# Altium schematic sheet Sheet1.SchDoc
size A4; SheetNumber: 1; SheetTotal: 1
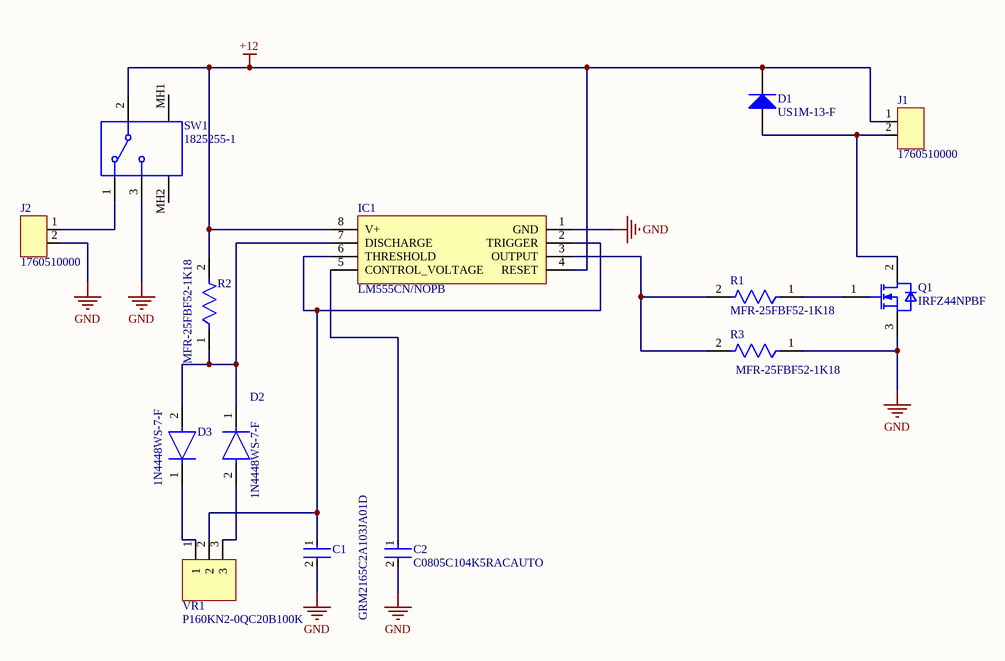
[diagram p0: Sheet1.SchDoc]

## Parts
C1  GRM2165C2A103JA01D  [FP-GRM216-0_1-0_05-IPC_C]
C2  C0805C104K5RACAUTO  [FP-C0805C-DN-MFG]
D1  US1M-13-F  [DIOD-SMA-2_A_V]
D2  1N4448WS-7-F  [FP-SOD323-MFG]
D3  1N4448WS-7-F  [FP-SOD323-MFG]
IC1  LM555CN/NOPB  [DIP794W45P254L959H508Q8]
J1  1760510000  [1760490000]
J2  1760510000  [1760490000]
Q1  IRFZ44NPBF  [IFX-PG-TO220-3-904-1]
R1  MFR-25FBF52-1K18  [FP-MFR-25-MFG]
R2  MFR-25FBF52-1K18  [FP-MFR-25-MFG]
R3  MFR-25FBF52-1K18  [FP-MFR-25-MFG]
SW1  1825255-1  [TECO-1825255-1_V]
VR1  P160KN2-0QC20B100K  [IC3_P160KN2-0QC20B100K_BIT]

## Nets
+12: D1.2(K) IC1.4(RESET) IC1.8(V+) J1.1 R2.2 SW1.2
GND: C1.2 C2.2 IC1.1(GND) J2.2 Q1.3(SOURCE) R3.1 SW1.3
NetC1_1: C1.1 IC1.2(TRIGGER) IC1.6(THRESHOLD) VR1.2
NetC2_1: C2.1 IC1.5(CONTROL_VOLTAGE)
NetD1_1: D1.1(A) J1.2 Q1.2(DRAIN)
NetD2_1: D2.1(C) D3.2(A) IC1.7(DISCHARGE) R2.1
NetD2_2: D2.2(A) VR1.3
NetD3_1: D3.1(C) VR1.1
NetIC1_3: IC1.3(OUTPUT) R1.2 R3.2
NetJ2_1: J2.1 SW1.1
NetQ1_1: Q1.1(GATE) R1.1

Not connected (* = marked no-connect by the designer): SW1 MH1 MH2

## Library data of the parts
C1 = CMP-06035-017805-1: Chip Multilayer Ceramic Capacitors for General Purpose, 0805, 10000pF, C0G, 30ppm/°C, 5%, 100V
C2 = CMP-2007-00278-2: CAP CER 0.1UF 50V X7R 0805; Manufacturer: KEMET; Material: Ceramic; Tolerance: 0.1; Capacitance: 0.10 μF; Value: 0.10 μF; Description: C0805 0.10 μF X7R 30ppm/°C 10.00% 50 V; Temperature Coefficient: 30ppm/°C; Voltage Rating: 50 V; Device Class L1: Passive Components; Device Class L3: Ceramic Capacitors; Temperature Characteristic: X7R; Manufacturer Part Number: C0805C104K5RACAUTO; Mouser Description: Multilayer Ceramic Capacitors MLCC - SMD/SMT 0.1uF 50volts 10% AUTO; Package: C0805C-DN; Digikey Description: CAP CER 0.1UF 50V X7R 0805; Height: 0.88mm; Automotive: No; Device Class L2: Capacitors; Category: Cap; Temperature: -55°C to +125°C; ComponentLink2URL: https://content.kemet.com/datasheets/KEM_C1003_C0G_SMD.pdf; Lead Free: Yes; Temperature Range Low: -55°C; Temperature Range High: +125°C; RoHS: TRUE; Ipc Land Pattern Name: CAPC200125X78; ComponentLink2Description: Datasheet; Octopart: https://octopart.com/c0805c104k5racauto-kemet-12625097
D1 = CMP-2000-07364-1: Ultra-Fast Rectifier, 1 A, 1.7 V, -65 to 150 degC, 2-Pin SMA, RoHS, Tape and Reel; Manufacturer: Diodes Inc; Forward Voltage: 1.7V; Reverse Recovery Time-Max: 75ns; Average Rectified Current-Max: 1A; Reverse Current-Max: 5µA; Reverse Voltage-Max [Vrrm]: 1000V; Package Description: 2-Pin Surface Mount Device, Body 4.3 x 2.605 mm; Datasheet URL: http://www.diodes.com/_files/datasheets/ds16008.pdf; Datasheet Version: Rev. 11-2, 12/2014; Package Reference: SMA-2; Mounting Technology: SurfaceMount; Manufacturer URL: http://www.diodes.com/
D2 D3 = CMP-12791-000011-1: DIODE GEN PURP 75V 250MA SOD323; Manufacturer: Diodes Incorporated; Forward Current: 500mA; Max Junction Temp: +150°C; Max Surge Forward Current: 0.5A; Value: 4pF; Peak Reverse Current: 2.5uA; Standoff Height: 0.05mm; ComponentLink2URL: https://www.diodes.com/assets/Datasheets/ds30096.pdf; ComponentLink2Description: Datasheet; Automotive: No; Temperature Range Low: -65°C; Package: SOD323; Temperature Range High: +150°C; Device Class L3: Rectifier Diodes; Reverse Voltage: 75V; Device Class L2: Diodes; Max Repetitive Reverse Voltage: 75V; Manufacturer Part Number: 1N4448WS-7-F; RoHS: TRUE; Lead Free: Yes; Temperature: -65°C to +150°C; Mouser Description: 1N4448WS Series 4 A 75 V 200 mW Surface Mount Fast Switching Diode - SOD-323; Capacitance: 4pF; Height: 1.2mm; Digikey Description: DIODE GEN PURP 75V 250MA SOD323; Octopart: https://octopart.com/1n4448ws-7-f-diodes+inc.-55389585; Footprint Url: https://www.diodes.com/assets/Package-Files/SOD323.pdf; Device Class L1: Discrete Semiconductors; Category: Diode
IC1 = LM555CN/NOPB: IC OSC SINGLE TIMER 100KHZ 8-DIP "555 Type, Timer/Oscillator (Single) IC 100kHz 8-PDIP"; Manufacturer: Texas Instruments; Manufacturer Lifecycle Status: ACTIVE; Manufacturer Package Identifier: P(R-PDIP--T8); Current Rating: 200A; High Level Output Current: -200mA; Low Level Output Current: 200mA; Max Junction Temperature (Tj): 70°C; Max Power Dissipation: 1.18W; Max Supply Voltage: 16V; Min Supply Voltage: 4.5V; Nominal Supply Current: 3mA; Number of Channels: 1; Operating Supply Current: 10mA; Supplier: DigiKey; Supplier Part Number: LM555CNNS/NOPB-ND; Manufacturer Part Number: LM555CN/NOPB; RoHS: Compliant; Category: Timers and Oscillators; Stock: 14598; Pricing: 1=1.44, 10=1.045, 40=0.90625, 120=0.82858, 280=0.78304, 520=0.75596, 1000=0.73206, 2520=0.70495, 5000=0.68894 (USD); Ambient Temperature Range High: 70°C; Case/Package: PDIP; Contact Plating: Tin; Frequency: 100kHz; Height: 5.08mm; Lead Free: Lead Free; Length: 9.81mm; Lifecycle Status: Production; Max Operating Temperature: 70°C; Min Operating Temperature: 0°C; Mount: Through Hole; Number of Pins: 8; Number of Timers/Counters: 1; Output Current: 200mA; Power Dissipation: 1.18W; Quiescent Current: 3mA; Radiation Hardening: No; REACH SVHC: Unaffected; Schedule B: 8542390000, 8542390000|8542390000|8542390000|8542390000|8542390000|8542390000|8542390000|8542390000|8542390000|8542390000|8542390000|8542390000|8542390000|8542390000|8542390000|8542390000|8542390000|8542390000|8542390000|8542390000|8542390000|8542390000|8542390000|85; Thickness: 3.9mm; Weight: 4.535924g; Width: 6.35mm; ComponentLink1URL: https://datasheet.octopart.com:443/LM555CN-NOPB-Texas-Instruments-datasheet-39144970.pdf?src-supplier=Texas+Instruments; ComponentLink1Description: https://datasheet.octopart.com:443/LM555CN-NOPB-Texas-Instruments-datasheet-39144970.pdf?src-supplier=Texas+Instruments; ComponentLink2URL: https://octopart.com:443/opatz8j6/c1?t=P9WJEuKpBNBQUNyDZTk4jrYEfZFxStfoFvCVy4zyfSvKfndzEk-HPsDKw6nWdCdN9BYUaBjSdlQxEtgzEOfQqYUxHZYj0MFD8BtoaQrN98rnk2ABdG3YuZhLly47aMb-yaBTjmH8iFOuBqfgHeCopvmqO6b-ug0lSNuacah300as_CwAluqpEy1P2MViceMlsYzHsM9V1fQEl8JIDwZG2ZgHryeoS_IuIWkEYb_ITxG-U4GmwsjED24hNxdr2L48pBClFoDw3YQ6sf9XlTKElbntYCe9Aii69H1ldAWBsiBXhMao6Z7iZVKXgozQ22O6PEKqYt-Glnfpjj9J-wCJ3UiYSu5f960Oh5TKe5VDlb3wh5lyrbEOZ0rU9g9jU7Nr7Xmz&src-supplier=Texas+Instruments; ComponentLink2Description: https://octopart.com:443/opatz8j6/c1?t=P9WJEuKpBNBQUNyDZTk4jrYEfZFxStfoFvCVy4zyfSvKfndzEk-HPsDKw6nWdCdN9BYUaBjSdlQxEtgzEOfQqYUxHZYj0MFD8BtoaQrN98rnk2ABdG3YuZhLly47aMb-yaBTjmH8iFOuBqfgHeCopvmqO6b-ug0lSNuacah300as_CwAluqpEy1P2MViceMlsYzHsM9V1fQEl8JIDwZG2ZgHryeoS_IuIWkEYb_ITxG-U4GmwsjED24hNxdr2L48pBClFoDw3YQ6sf9XlTKElbntYCe9Aii69H1ldAWBsiBXhMao6Z7iZVKXgozQ22O6PEKqYt-Glnfpjj9J-wCJ3UiYSu5f960Oh5TKe5VDlb3wh5lyrbEOZ0rU9g9jU7Nr7Xmz&src-supplier=Texas+Instruments; ComponentLink3URL: https://datasheet.octopart.com:443/LM555CN-NOPB-Texas-Instruments-datasheet-36834611.pdf?src-supplier=Texas+Instruments; ComponentLink3Description: https://datasheet.octopart.com:443/LM555CN-NOPB-Texas-Instruments-datasheet-36834611.pdf?src-supplier=Texas+Instruments; ComponentLink4URL: https://datasheet.octopart.com:443/LM555CN-NOPB-Texas-Instruments-datasheet-14540375.pdf?src-supplier=Texas+Instruments; ComponentLink4Description: https://datasheet.octopart.com:443/LM555CN-NOPB-Texas-Instruments-datasheet-14540375.pdf?src-supplier=Texas+Instruments; ComponentLink5URL: https://sigma.octopart.com:443/49250158/technical_drawing/Texas-Instruments-LM555CN-NOPB.pdf?src-supplier=Texas+Instruments; ComponentLink5Description: https://sigma.octopart.com:443/49250158/technical_drawing/Texas-Instruments-LM555CN-NOPB.pdf?src-supplier=Texas+Instruments; ComponentLink6URL: https://datasheet.octopart.com:443/LM555CN/NOPB-Texas-Instruments-datasheet-10617826.pdf?src-supplier=element14; ComponentLink6Description: https://datasheet.octopart.com:443/LM555CN/NOPB-Texas-Instruments-datasheet-10617826.pdf?src-supplier=element14; ComponentLink7URL: https://datasheet.octopart.com:443/LM555CN-NOPB-Texas-Instruments-datasheet-34116.pdf?src-supplier=element14; ComponentLink7Description: https://datasheet.octopart.com:443/LM555CN-NOPB-Texas-Instruments-datasheet-34116.pdf?src-supplier=element14; ComponentLink8URL: https://datasheet.octopart.com:443/LM555CN-NOPB-Texas-Instruments-datasheet-62346024.pdf?src-supplier=Farnell; ComponentLink8Description: https://datasheet.octopart.com:443/LM555CN-NOPB-Texas-Instruments-datasheet-62346024.pdf?src-supplier=Farnell; ComponentLink9URL: https://datasheet.octopart.com:443/LM555CN-NOPB-Texas-Instruments-datasheet-27844323.pdf?src-supplier=Farnell; ComponentLink9Description: https://datasheet.octopart.com:443/LM555CN-NOPB-Texas-Instruments-datasheet-27844323.pdf?src-supplier=Farnell; ComponentLink10URL: https://datasheet.octopart.com:443/LM555CN-NOPB-Texas-Instruments-datasheet-24897031.pdf?src-supplier=Farnell; ComponentLink10Description: https://datasheet.octopart.com:443/LM555CN-NOPB-Texas-Instruments-datasheet-24897031.pdf?src-supplier=Farnell; ComponentLink11URL: https://datasheet.octopart.com:443/LM555CN-NOPB-Texas-Instruments-datasheet-21076736.pdf?src-supplier=element14+APAC; ComponentLink11Description: https://datasheet.octopart.com:443/LM555CN-NOPB-Texas-Instruments-datasheet-21076736.pdf?src-supplier=element14+APAC; ComponentLink12URL: https://datasheet.octopart.com:443/LM555CN-NOPB-Texas-Instruments-datasheet-164415203.pdf?src-supplier=SHENGYU+ELECTRONICS; ComponentLink12Description: https://datasheet.octopart.com:443/LM555CN-NOPB-Texas-Instruments-datasheet-164415203.pdf?src-supplier=SHENGYU+ELECTRONICS; ComponentLink13URL: https://datasheet.octopart.com:443/LM555CN-NOPB-Texas-Instruments-datasheet-38190905.pdf?src-supplier=Newark; ComponentLink13Description: https://datasheet.octopart.com:443/LM555CN-NOPB-Texas-Instruments-datasheet-38190905.pdf?src-supplier=Newark; ComponentLink14URL: https://datasheet.octopart.com:443/LM555CN/NOPB-National-Semiconductor-datasheet-14043549.pdf?src-supplier=iiiC; ComponentLink14Description: https://datasheet.octopart.com:443/LM555CN/NOPB-National-Semiconductor-datasheet-14043549.pdf?src-supplier=iiiC; ComponentLink15URL: https://datasheet.octopart.com:443/LM555CN/NOPB-National-Semiconductor-datasheet-7281965.pdf?src-supplier=Jameco+(USA); ComponentLink15Description: https://datasheet.octopart.com:443/LM555CN/NOPB-National-Semiconductor-datasheet-7281965.pdf?src-supplier=Jameco+(USA); ComponentLink16URL: http://sigma.octopart.com:80/reach_statement/Texas-Instruments-company-64.pdf?src-supplier=Compliance+Statements; ComponentLink16Description: http://sigma.octopart.com:80/reach_statement/Texas-Instruments-company-64.pdf?src-supplier=Compliance+Statements; ComponentLink17URL: http://sigma.octopart.com:80/conflict_mineral_statement/Texas-Instruments-company-63.pdf?src-supplier=Compliance+Statements; ComponentLink17Description: http://sigma.octopart.com:80/conflict_mineral_statement/Texas-Instruments-company-63.pdf?src-supplier=Compliance+Statements
J1 J2 = 1760510000: Weidmuller PCB Terminal Block PM Series, 2-Ch, 5.08mm Pitch, TH, Screw Termination, Black; Approvals: CSA, IEC, UL, VDE, cUL; Connector Type: PCB, Terminal Block; Current: 15A; Max Current Rating: 16A; Max Supply Voltage: 300V; Number of Circuits: 2; Number of Levels: 1; Wire/Cable Gauge: 14AWG; Wire Gauge (Max): 26AWG; Supplier: DigiKey; Supplier Part Number: 281-1882-ND; Manufacturer: Weidmuller; Manufacturer Part Number: 1760510000; RoHS: Compliant; Category: Terminal Blocks; Stock: 31277; Pricing: 1=0.8, 10=0.592, 25=0.516, 50=0.465, 100=0.4205, 250=0.37204, 500=0.34274, 1000=0.31901, 5000=0.28104 (USD); Color: Black; Contact Material: Nickel, Tin; Contact Plating: Tin; Country of Origin: Mainland China; Current Rating: 15A; Depth: 8mm; Export Control Classification Number (ECCN) Code: EAR99; Flammability Rating: UL94 V-0; Height: 10mm; Housing Color: Black; Harmonized Tariff Schedule (HTS) Code: 8536.90.40.00; Introduction Date: 2001-05-15; Lead Free: Contains Lead; Length: 11.2mm; Lifecycle Status: Production; Max Operating Temperature: 120°C; Min Operating Temperature: -50°C; Mount: Solder; Number of Contacts: 2; Number of Pins: 2; Number of Positions: 2; Number of Positions Per Level: 2; Number of Rows: 1; Orientation: Straight; Pitch: 5.08mm; Radiation Hardening: No; REACH SVHC: Affected; Termination: Solder; Voltage: 300V; Voltage Rating: 300V; Width: 8mm; Wire Gauge (Min): 14AWG; ComponentLink1URL: https://datasheet.octopart.com:443/1760510000-Weidmuller-datasheet-181506134.pdf?src-supplier=IHS; ComponentLink1Description: https://datasheet.octopart.com:443/1760510000-Weidmuller-datasheet-181506134.pdf?src-supplier=IHS; ComponentLink2URL: https://datasheet.octopart.com:443/1760510000-Weidmuller-datasheet-83001070.pdf?src-supplier=Master+Electronics; ComponentLink2Description: https://datasheet.octopart.com:443/1760510000-Weidmuller-datasheet-83001070.pdf?src-supplier=Master+Electronics; ComponentLink3URL: https://datasheet.octopart.com:443/1760510000-Weidmuller-datasheet-154819650.pdf?src-supplier=Electro+Sonic; ComponentLink3Description: https://datasheet.octopart.com:443/1760510000-Weidmuller-datasheet-154819650.pdf?src-supplier=Electro+Sonic; ComponentLink4URL: https://datasheet.octopart.com:443/1760510000-Weidmuller-datasheet-42752043.pdf?src-supplier=Electro+Sonic; ComponentLink4Description: https://datasheet.octopart.com:443/1760510000-Weidmuller-datasheet-42752043.pdf?src-supplier=Electro+Sonic; ComponentLink5URL: https://datasheet.octopart.com:443/1760510000-Weidmuller-datasheet-41486043.pdf?src-supplier=element14+APAC; ComponentLink5Description: https://datasheet.octopart.com:443/1760510000-Weidmuller-datasheet-41486043.pdf?src-supplier=element14+APAC; ComponentLink6URL: https://datasheet.octopart.com:443/1760510000-Weidmuller-datasheet-177944115.pdf?src-supplier=Burklin+Elektronik; ComponentLink6Description: https://datasheet.octopart.com:443/1760510000-Weidmuller-datasheet-177944115.pdf?src-supplier=Burklin+Elektronik; ComponentLink7URL: https://datasheet.octopart.com:443/1760510000-Weidmuller-datasheet-21274839.pdf?src-supplier=Newark; ComponentLink7Description: https://datasheet.octopart.com:443/1760510000-Weidmuller-datasheet-21274839.pdf?src-supplier=Newark; ComponentLink8URL: https://datasheet.octopart.com:443/1760510000-Weidmuller-datasheet-8814545.pdf?src-supplier=element14; ComponentLink8Description: https://datasheet.octopart.com:443/1760510000-Weidmuller-datasheet-8814545.pdf?src-supplier=element14
Q1 = IRFZ44NPBF: MOSFET, Power; N-Ch; VDSS 55V; RDS(ON) 17.5 Milliohms; ID 49A; TO-220AB; PD 94W; -55deg; Manufacturer: Infineon; Drain to Source Resistance: 17.5mΩ; Element Configuration: Single; Fall Time: 45ns; Gate to Source Voltage (Vgs): 20V; Input Capacitance: 1.47nF; Max Junction Temperature (Tj): 175°C; Nominal Vgs: 2.1V; Number of Elements: 1; Power Dissipation: 83W; Recovery Time: 95ns; Rise Time: 60ns; Turn-Off Delay Time: 44ns; Turn-On Delay Time: 12ns; Supplier: DigiKey; Supplier Part Number: IRFZ44NPBF-ND; Manufacturer Part Number: IRFZ44NPBF; RoHS: Compliant; Category: MOSFETs; Stock: 6269; Pricing: 1=1.44, 10=0.907, 50=0.6742, 100=0.5987, 500=0.46614 (USD); Case/Package: TO-220AB; Contact Plating: Tin; Continuous Drain Current (ID): 49A; Country of Origin: Mainland China, Mexico; Current Rating: 49A; Drain to Source Breakdown Voltage: 55V; Drain to Source Voltage (Vds): 55V; Dual Supply Voltage: 55V; Export Control Classification Number (ECCN) Code: EAR99; Height: 8.77mm; Harmonized Tariff Schedule (HTS) Code: 8541.29.00.95; Introduction Date: 2003-10-31; Lead Free: Lead Free; Lead Pitch: 2.54mm; Length: 10.668mm; Lifecycle Status: Production; Max Operating Temperature: 175°C; Max Power Dissipation: 94W; Min Breakdown Voltage: 55V; Min Operating Temperature: -55°C; Mount: Through Hole; Number of Pins: 3; Number of Terminals: 3; On-State Resistance: 17.5mΩ; Package Quantity: 1000; Packaging: Bulk; Radiation Hardening: No; Rds On Max: 17.5mΩ; REACH SVHC: Unaffected; Resistance: 17.5MΩ; Schedule B: 8541290080, 8541290080|8541290080, 8541290080|8541290080|8541290080, 8541290080|8541290080|8541290080|8541290080; Termination: Through Hole; Threshold Voltage: 2.1V; Voltage Rating (DC): 55V; Width: 4.826mm; ComponentLink1URL: https://datasheet.octopart.com:443/IRFZ44NPBF-Infineon-datasheet-10898344.pdf?src-supplier=IHS; ComponentLink1Description: https://datasheet.octopart.com:443/IRFZ44NPBF-Infineon-datasheet-10898344.pdf?src-supplier=IHS; ComponentLink2URL: https://datasheet.octopart.com:443/IRFZ44NPBF-Infineon-datasheet-180070255.pdf?src-supplier=element14+APAC; ComponentLink2Description: https://datasheet.octopart.com:443/IRFZ44NPBF-Infineon-datasheet-180070255.pdf?src-supplier=element14+APAC; ComponentLink3URL: https://datasheet.octopart.com:443/IRFZ44NPBF-Infineon-datasheet-163297.pdf?src-supplier=Farnell; ComponentLink3Description: https://datasheet.octopart.com:443/IRFZ44NPBF-Infineon-datasheet-163297.pdf?src-supplier=Farnell; ComponentLink4URL: https://datasheet.octopart.com/IRFZ44NPBF-Infineon-datasheet-7575919.pdf; ComponentLink4Description: https://datasheet.octopart.com/IRFZ44NPBF-Infineon-datasheet-7575919.pdf; ComponentLink5URL: https://datasheet.octopart.com:443/IRFZ44N-International-Rectifier-datasheet-82086.pdf?src-supplier=Newark; ComponentLink5Description: https://datasheet.octopart.com:443/IRFZ44N-International-Rectifier-datasheet-82086.pdf?src-supplier=Newark; ComponentLink6URL: https://datasheet.octopart.com:443/IRFZ44NPBF-International-Rectifier-datasheet-7564879.pdf?src-supplier=_legacy+Avnet; ComponentLink6Description: https://datasheet.octopart.com:443/IRFZ44NPBF-International-Rectifier-datasheet-7564879.pdf?src-supplier=_legacy+Avnet; ComponentLink7URL: https://datasheet.octopart.com:443/IRFZ44NPBF-International-Rectifier-datasheet-14061588.pdf?src-supplier=iiiC; ComponentLink7Description: https://datasheet.octopart.com:443/IRFZ44NPBF-International-Rectifier-datasheet-14061588.pdf?src-supplier=iiiC; ComponentLink8URL: https://datasheet.octopart.com:443/IRFZ44N-International-Rectifier-datasheet-10733621.pdf?src-supplier=iiiC; ComponentLink8Description: https://datasheet.octopart.com:443/IRFZ44N-International-Rectifier-datasheet-10733621.pdf?src-supplier=iiiC; ComponentLink9URL: https://datasheet.octopart.com:443/IRFZ44NPBF-Infineon-datasheet-9874387.pdf?src-supplier=RS+(Formerly+Allied+Electronics); ComponentLink9Description: https://datasheet.octopart.com:443/IRFZ44NPBF-Infineon-datasheet-9874387.pdf?src-supplier=RS+(Formerly+Allied+Electronics); ComponentLink10URL: https://datasheet.octopart.com:443/IRFZ44N-International-Rectifier-datasheet-58767.pdf?src-supplier=RS+(Formerly+Allied+Electronics); ComponentLink10Description: https://datasheet.octopart.com:443/IRFZ44N-International-Rectifier-datasheet-58767.pdf?src-supplier=RS+(Formerly+Allied+Electronics); ComponentLink11URL: https://datasheet.octopart.com:443/IRFZ44NPBF-Infineon-datasheet-7280676.pdf?src-supplier=Jameco+(USA); ComponentLink11Description: https://datasheet.octopart.com:443/IRFZ44NPBF-Infineon-datasheet-7280676.pdf?src-supplier=Jameco+(USA); ComponentLink12URL: https://datasheet.octopart.com:443/IRFZ44NPBF-International-Rectifier-datasheet-92204.pdf?src-supplier=DigiKey; ComponentLink12Description: https://datasheet.octopart.com:443/IRFZ44NPBF-International-Rectifier-datasheet-92204.pdf?src-supplier=DigiKey; ComponentLink13URL: http://sigma.octopart.com:80/conflict_mineral_statement/Infineon-company-51.pdf?src-supplier=Compliance+Statements; ComponentLink13Description: http://sigma.octopart.com:80/conflict_mineral_statement/Infineon-company-51.pdf?src-supplier=Compliance+Statements; ComponentLink14URL: http://sigma.octopart.com:80/reach_statement/International-Rectifier-company-55.pdf?src-supplier=Compliance+Statements; ComponentLink14Description: http://sigma.octopart.com:80/reach_statement/International-Rectifier-company-55.pdf?src-supplier=Compliance+Statements; ComponentLink15URL: http://sigma.octopart.com:80/rohs_statement/International-Rectifier-company-54.pdf?src-supplier=Compliance+Statements; ComponentLink15Description: http://sigma.octopart.com:80/rohs_statement/International-Rectifier-company-54.pdf?src-supplier=Compliance+Statements
R1-R3 = CMP-03413-000001-1: RES 1.18K OHM 1/4W 1% AXIAL; Manufacturer: Yageo; Value: 1.18kΩ; Description: 1.18 kOhms ±1% 0.25W, 1/4W Through Hole Resistor Axial  Metal Film; Temperature Coefficient: 100ppm/°C; Power Rating: 0.25W; Voltage Rating: 250V; Temperature: -55°C to +155°C; Automotive: No; Temperature Range High: +155°C; Mouser Description: Metal Film Resistors 1.18K OHM 1/4W 1%; Digikey Description: RES 1.18K OHM 1/4W 1% AXIAL; Lead Free: Yes; Tolerance: 1%; ComponentLink2Description: Datasheet; ComponentLink2URL: https://www.yageo.com/upload/media/product/products/datasheet/lr/Yageo_LR_MFR_1.pdf; Temperature Range Low: -55°C; Package: MFR-25; Ipc Land Pattern Name: RESAD1000W75L680D260; Composition: Metal Film; Category: Res; Octopart: https://octopart.com/mfr-25fbf52-1k18-yageo-56251681; Series: MFR; Device Class L2: Resistors; Height: 2.6mm; Resistance: 1.18kΩ; Device Class L3: Through-Hole Resistors; Manufacturer Part Number: MFR-25FBF52-1K18; RoHS: TRUE; Device Class L1: Passive Components
SW1 = CMP-2100-03576-1: Slide Switch, SPDT, 125 V, -20 to 85 degC, 5-Pin THD, RoHS, Tray; Manufacturer: TE Connectivity; Electrical Life: 15000Cycles; Number of Positions: 2; Operating Force: 600gf; Max Voltage Rating (AC): 125V; Actuator Length: 4.5mm; Current Rating: 300mA; Contact Style: Shorting; Switch Travel: 4mm; Flammability Rating: UL94HB; Termination: PCPins; Package Quantity: 560; Throw Configuration: SPDT; Datasheet Version: Rev. A4, 03/2014; Mount: ThroughHole; Package Reference: 1825255-1; Case/Package: 300; Depth: 6.7mm; Packaging: Bulk; Package Description: 5-Pin Through Hole Device, Body 6.7 x 16 mm, Pitch 4 mm; REACH SVHC: Unknown; ELV: Compliant; Voltage Rating (AC): 125V; Max Current Rating: 300mA; Radiation Hardening: No; Min Operating Temperature: -20degC; Contact Plating: Silver; Length: 16mm; Manufacturer URL: http://www.te.com/; Orientation: Vertical; Contact Material: Copper; RoHSCompliant: true; Lead Free: LeadFree; Max Operating Temperature: 85degC; Datasheet URL: http://www.te.com/commerce/DocumentDelivery/DDEController?Action=showdoc&DocId=Customer+Drawing%7F1825255%7FA4%7Fpdf%7FEnglish%7FENG_CD_1825255_A4_baseFilename.pdf%7F1825255-1
VR1 = P160KN2-0QC20B100K: Potentiometer, Conductive Plastic, 0.2W, 100000ohm, 20% +/-Tol, 1 Turn(s); Manufacturer: TT Electronics; Number of Turns: 1; Power Rating: 200mW; Resistance: 100kΩ; Supplier: Mouser; Supplier Part Number: 858-P160KN20C20B100K; Manufacturer Part Number: P160KN2-0QC20B100K; RoHS: Compliant; Category: Variable Resistors and Potentiometers; Stock: 4009; Pricing: 1=2.07, 10=1.67, 50=1.53, 100=1.34, 1000=1.05, 10000=0.868 (USD); Composition: Conductive Plastic; Diameter: 16.5mm; Length: 9.5mm; Lifecycle Status: Production; Max Operating Temperature: 70°C; Min Operating Temperature: -20°C; Number of Terminals: 3; REACH SVHC: Affected; Tolerance: 20%; ComponentLink1URL: https://datasheet.octopart.com:443/P160KN2-0QC20B100K-BI-Technologies-datasheet-154728231.pdf?src-supplier=IHS; ComponentLink1Description: https://datasheet.octopart.com:443/P160KN2-0QC20B100K-BI-Technologies-datasheet-154728231.pdf?src-supplier=IHS; ComponentLink2URL: https://datasheet.octopart.com:443/P160KN2-0QC20B100K-BI-Technologies-datasheet-8329726.pdf?src-supplier=Sager+Electronics; ComponentLink2Description: https://datasheet.octopart.com:443/P160KN2-0QC20B100K-BI-Technologies-datasheet-8329726.pdf?src-supplier=Sager+Electronics